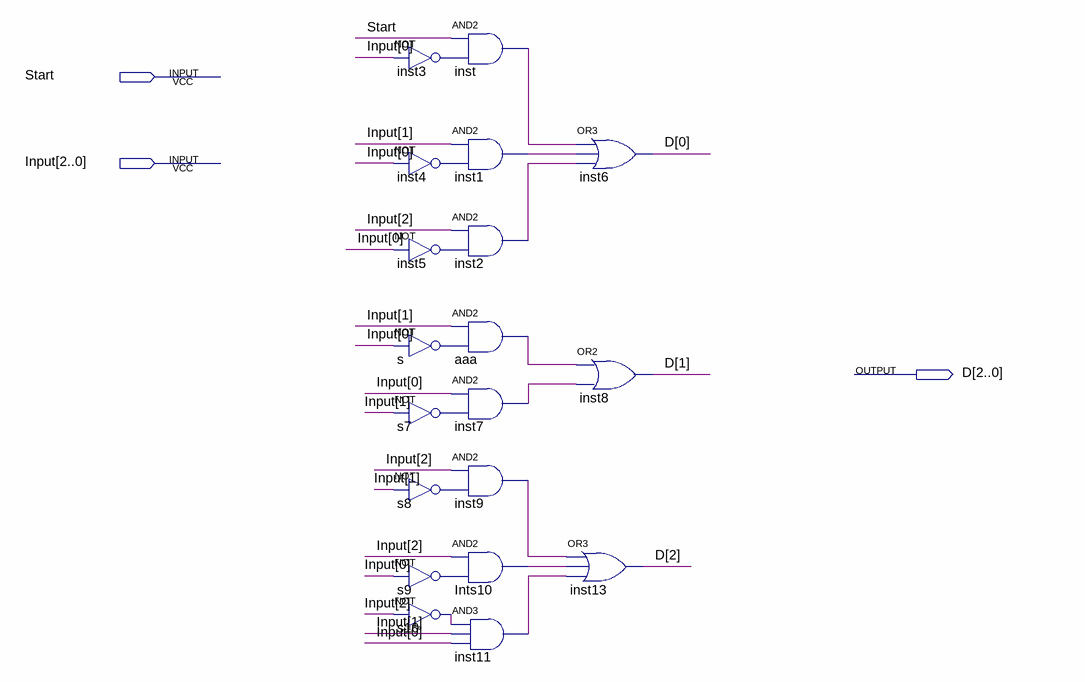
[diagram p0: schematic sheet]
// Quartus schematic Next_state.bdf as structural Verilog: 19 symbols, 3 pins
module Next_state (
  input  Start,
  input  [2:0] Input,
  output [2:0] D
);

  wire aaa_out, inst1_out, inst2_out, inst3_out, inst4_out, inst5_out, inst7_out, inst9_out, inst11_out,
       inst_out, Ints10_out, s7_out, s8_out, s9_out, s10_out, s_out;

  not inst3 (inst3_out, Input[0]);
  not inst4 (inst4_out, Input[0]);
  not inst5 (inst5_out, Input[0]);
  not s (s_out, Input[0]);
  not s7 (s7_out, Input[1]);
  not s8 (s8_out, Input[1]);
  not s9 (s9_out, Input[0]);
  not s10 (s10_out, Input[2]);
  and inst (inst_out, Start, inst3_out);
  and inst1 (inst1_out, Input[1], inst4_out);
  and inst2 (inst2_out, Input[2], inst5_out);
  and aaa (aaa_out, Input[1], s_out);
  and inst7 (inst7_out, Input[0], s7_out);
  and inst9 (inst9_out, Input[2], s8_out);
  and Ints10 (Ints10_out, Input[2], s9_out);
  and inst11 (inst11_out, s10_out, Input[1], Input[0]);
  or inst6 (D[0], inst_out, inst1_out, inst2_out);
  or inst8 (D[1], aaa_out, inst7_out);
  or inst13 (D[2], inst9_out, Ints10_out, inst11_out);
endmodule
